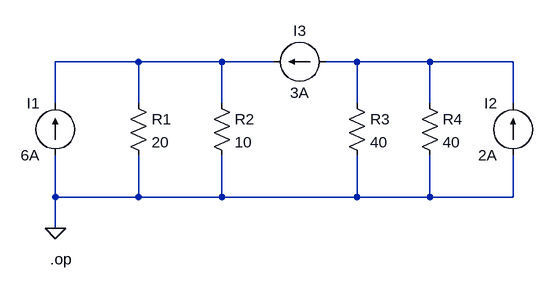
[diagram p0: schematic resistors+sources-2.asc]
resistors+sources-2.asc, the LTspice schematic file:
Version 4
SHEET 1 880 680
WIRE 128 208 0 208
WIRE 256 208 128 208
WIRE 336 208 256 208
WIRE 464 208 416 208
WIRE 576 208 464 208
WIRE 704 208 576 208
WIRE 0 272 0 208
WIRE 128 272 128 208
WIRE 256 272 256 208
WIRE 464 272 464 208
WIRE 576 272 576 208
WIRE 704 272 704 208
WIRE 0 416 0 352
WIRE 128 416 128 352
WIRE 128 416 0 416
WIRE 256 416 256 352
WIRE 256 416 128 416
WIRE 464 416 464 352
WIRE 464 416 256 416
WIRE 576 416 576 352
WIRE 576 416 464 416
WIRE 704 416 704 352
WIRE 704 416 576 416
WIRE 0 464 0 416
FLAG 0 464 0
SYMBOL current 0 352 R180
WINDOW 0 24 80 Left 2
WINDOW 3 24 0 Left 2
SYMATTR InstName I1
SYMATTR Value 6A
SYMBOL current 704 352 R180
WINDOW 0 24 80 Left 2
WINDOW 3 24 0 Left 2
SYMATTR InstName I2
SYMATTR Value 2A
SYMBOL current 416 208 R90
WINDOW 0 -32 40 VBottom 2
WINDOW 3 32 40 VTop 2
SYMATTR InstName I3
SYMATTR Value 3A
SYMBOL res 112 256 R0
SYMATTR InstName R1
SYMATTR Value 20
SYMBOL res 240 256 R0
SYMATTR InstName R2
SYMATTR Value 10
SYMBOL res 448 256 R0
SYMATTR InstName R3
SYMATTR Value 40
SYMBOL res 560 256 R0
SYMATTR InstName R4
SYMATTR Value 40
TEXT -8 512 Left 2 !.op

The netlist it stands for:
* resistors+sources-2.asc
I1 0 N001 6A
I2 0 N002 2A
I3 N002 N001 3A
R1 N001 0 20
R2 N001 0 10
R3 N002 0 40
R4 N002 0 40
.op
.backanno
.end